# Altium schematic sheet 18650 Battery Pack.SchDoc
size A4
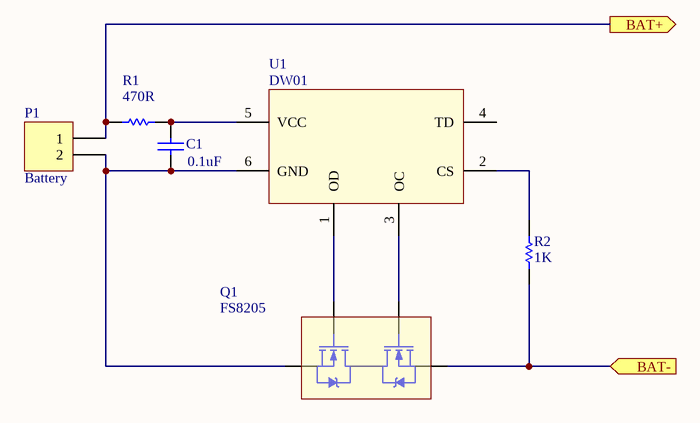
[diagram p0: 18650 Battery Pack.SchDoc]

## Parts
C1  value 0.1uF  [RAD-0.3]  (hidden comment: 0603)
P1  Battery  [HDR1X2]
Q1  FS8205  [SOT23-6_N]
R1  value 470R  [AXIAL-0.3]  (hidden comment: 0603)
R2  value 1K  [AXIAL-0.3]  (hidden comment: 0603)
U1  DW01

## Ports
BAT+ (out), BAT- (in)

## Nets
BAT+: P1.1 R1.1 ; port BAT+
BAT-: Q1.3(S2) R2.1 ; port BAT-
NetC1_1: C1.1 P1.2 Q1.1(S1) U1.6(GND)
NetC1_2: C1.2 R1.2 U1.5(VCC)
NetQ1_4: Q1.4(G2) U1.3(OC)
NetQ1_6: Q1.6(G1) U1.1(OD)
NetR2_2: R2.2 U1.2(CS)

Not connected (* = marked no-connect by the designer): Q1 2(D12) 5(D12); U1 4(TD)

## Library data of the parts
C1 = Cap: Capacitor; Published: 8-Jun-2000; LatestRevisionDate: 17-Jul-2002; LatestRevisionNote: Re-released for DXP Platform.; PackageReference: RAD-0.3; Publisher: Altium Limited; PackageDescription: Radial Cap, Thru-Hole; 2 Leads; 0.3 in Pin Spacing
P1 = Header 2: Header, 2-Pin; LatestRevisionDate: 17-Jul-2002; LatestRevisionNote: Re-released for DXP Platform.; Publisher: Altium Limited
Q1 = FS8205: FS8205 Dual MOS
R1 R2 = Res1: Resistor; Published: 8-Jun-2000; LatestRevisionDate: 17-Jul-2002; LatestRevisionNote: Re-released for DXP Platform.; PackageReference: AXIAL-0.3; Publisher: Altium Limited; PackageDescription: Axial Device, Thru-Hole; 2 Leads; 0.3 in Pin Spacing
U1 = DW01: Battery Protector